# Altium schematic sheet mainSchema.SchDoc
size A4; SheetNumber: 1; SheetTotal: 9
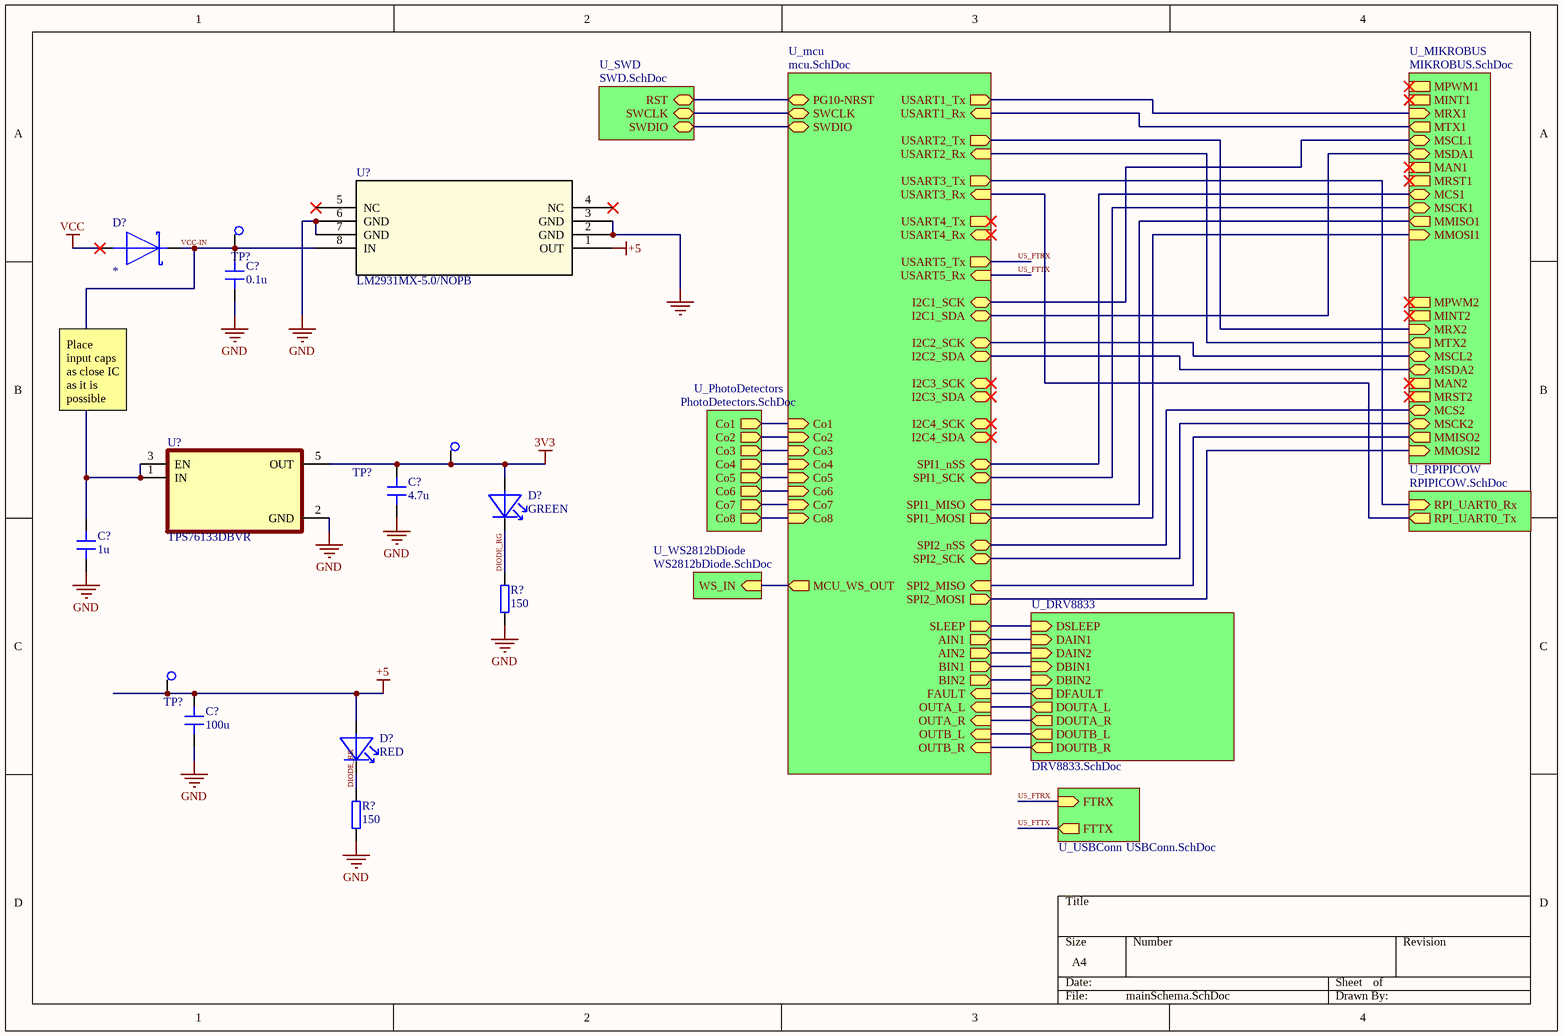
[diagram p0: mainSchema.SchDoc]

## Parts
(Parts that share a designator on the sheet are numbered #1, #2 ... from top to bottom, then left to right.)
C?#1  0.1u
C?#2  4.7u
C?#3  1u
C?#4  100u
D?#1  *
D?#2  GREEN
D?#3  RED
R?#1  150
R?#2  150
TP?#1  *  [TestPoint]  (value not drawn)
TP?#2  *  [TestPoint]  (value not drawn)
TP?#3  *  [TestPoint]  (value not drawn)
U?#1  LM2931MX-5.0/NOPB  [M08A_TEX]
U?#2  TPS76133DBVR  [SOT95P280X145-5N]

## Sub-sheets
U_DRV8833 = DRV8833.SchDoc: DOUTB_R (out), DOUTA_R (out), DOUTB_L (out), DOUTA_L (out), DAIN1 (in), DBIN1 (in), DAIN2 (in), DBIN2 (in), DSLEEP (in), DFAULT (out)
U_mcu = mcu.SchDoc: PG10-NRST (bidir), SWCLK (bidir), SWDIO (bidir), USART1_Tx (out), USART1_Rx (in), USART2_Tx (out), USART2_Rx (in), USART3_Tx (out), USART3_Rx (in), USART4_Tx (out), USART4_Rx (in), USART5_Tx (out), USART5_Rx (in), I2C1_SCK (bidir), I2C1_SDA (bidir), I2C2_SCK (bidir), I2C2_SDA (bidir), I2C3_SCK (bidir), I2C3_SDA (bidir), I2C4_SCK (bidir), I2C4_SDA (bidir), SPI1_nSS (bidir), SPI1_SCK (bidir), SPI1_MISO (in), SPI1_MOSI (out), SPI2_nSS (bidir), SPI2_SCK (bidir), SPI2_MISO (in), SPI2_MOSI (out), Co1 (in), Co2 (in), Co3 (in), Co4 (in), Co5 (in), Co6 (in), Co7 (in), Co8 (in), AIN1 (out), AIN2 (out), BIN1 (out), BIN2 (out), FAULT (in), OUTA_L (in), OUTA_R (in), OUTB_L (in), OUTB_R (in), SLEEP (out), MCU_WS_OUT (out)
U_MIKROBUS = MIKROBUS.SchDoc: MPWM1, MINT1, MRX1 (in), MTX1 (out), MSCL1 (bidir), MSDA1 (bidir), MAN1, MRST1, MCS1 (bidir), MSCK1 (bidir), MMISO1 (out), MMOSI1 (in), MPWM2, MINT2, MRX2 (in), MTX2 (out), MSCL2 (bidir), MSDA2 (bidir), MAN2, MRST2, MCS2 (bidir), MSCK2 (bidir), MMISO2 (out), MMOSI2 (in)
U_PhotoDetectors = PhotoDetectors.SchDoc: Co1 (out), Co2 (out), Co3 (out), Co4 (out), Co5 (out), Co6 (out), Co7 (out), Co8 (out)
U_RPIPICOW = RPIPICOW.SchDoc: RPI_UART0_Tx (out), RPI_UART0_Rx (in)
U_SWD = SWD.SchDoc: SWDIO (bidir), SWCLK (bidir), RST (bidir)
U_USBConn = USBConn.SchDoc: FTRX (in), FTTX (out)
U_WS2812bDiode = WS2812bDiode.SchDoc: WS_IN (in)

## Nets
3V3: C?#2.2 D?#2.1 TP?#2.1 U?#2.5(OUT)
+5: C?#4.2 D?#3.1 TP?#3.1 U?#1.1(OUT)
GND: C?#1.1 C?#2.1 C?#3.1 C?#4.1 R?#1.1 R?#2.1 U?#1.6(GND) U?#1.7(GND) U?#2.2(GND)
NetU?#1_2: U?#1.2(GND) U?#1.3(GND)
VCC: D?#1.1
DIODE_RG: D?#2.2 R?#1.2
DIODE_RR: D?#3.2 R?#2.2
U5_FTRX: sheet U_mcu/USART5_Tx, sheet U_USBConn/FTRX
U5_FTTX: sheet U_mcu/USART5_Rx, sheet U_USBConn/FTTX
VCC-IN: C?#1.2 C?#3.2 D?#1.2 TP?#1.1 U?#1.8(IN) U?#2.1(IN) U?#2.3(EN)
(unnamed): sheet U_mcu/PG10-NRST, sheet U_SWD/RST
(unnamed): sheet U_mcu/SWCLK, sheet U_SWD/SWCLK
(unnamed): sheet U_mcu/SWDIO, sheet U_SWD/SWDIO
(unnamed): sheet U_mcu/USART1_Tx, sheet U_MIKROBUS/MRX1
(unnamed): sheet U_mcu/USART1_Rx, sheet U_MIKROBUS/MTX1
(unnamed): sheet U_mcu/USART2_Tx, sheet U_MIKROBUS/MRX2
(unnamed): sheet U_mcu/USART2_Rx, sheet U_MIKROBUS/MTX2
(unnamed): sheet U_mcu/USART3_Tx, sheet U_RPIPICOW/RPI_UART0_Rx
(unnamed): sheet U_mcu/USART3_Rx, sheet U_RPIPICOW/RPI_UART0_Tx
(unnamed): sheet U_mcu/I2C1_SCK, sheet U_MIKROBUS/MSCL1
(unnamed): sheet U_mcu/I2C1_SDA, sheet U_MIKROBUS/MSDA1
(unnamed): sheet U_mcu/I2C2_SCK, sheet U_MIKROBUS/MSCL2
(unnamed): sheet U_mcu/I2C2_SDA, sheet U_MIKROBUS/MSDA2
(unnamed): sheet U_mcu/SPI1_nSS, sheet U_MIKROBUS/MCS1
(unnamed): sheet U_mcu/SPI1_SCK, sheet U_MIKROBUS/MSCK1
(unnamed): sheet U_mcu/SPI1_MISO, sheet U_MIKROBUS/MMISO1
(unnamed): sheet U_mcu/SPI1_MOSI, sheet U_MIKROBUS/MMOSI1
(unnamed): sheet U_mcu/SPI2_nSS, sheet U_MIKROBUS/MCS2
(unnamed): sheet U_mcu/SPI2_SCK, sheet U_MIKROBUS/MSCK2
(unnamed): sheet U_mcu/SPI2_MISO, sheet U_MIKROBUS/MMISO2
(unnamed): sheet U_mcu/SPI2_MOSI, sheet U_MIKROBUS/MMOSI2
(unnamed): sheet U_mcu/Co1, sheet U_PhotoDetectors/Co1
(unnamed): sheet U_mcu/Co2, sheet U_PhotoDetectors/Co2
(unnamed): sheet U_mcu/Co3, sheet U_PhotoDetectors/Co3
(unnamed): sheet U_mcu/Co4, sheet U_PhotoDetectors/Co4
(unnamed): sheet U_mcu/Co5, sheet U_PhotoDetectors/Co5
(unnamed): sheet U_mcu/Co6, sheet U_PhotoDetectors/Co6
(unnamed): sheet U_mcu/Co7, sheet U_PhotoDetectors/Co7
(unnamed): sheet U_mcu/Co8, sheet U_PhotoDetectors/Co8
(unnamed): sheet U_mcu/AIN1, sheet U_DRV8833/DAIN1
(unnamed): sheet U_mcu/AIN2, sheet U_DRV8833/DAIN2
(unnamed): sheet U_mcu/BIN1, sheet U_DRV8833/DBIN1
(unnamed): sheet U_mcu/BIN2, sheet U_DRV8833/DBIN2
(unnamed): sheet U_mcu/FAULT, sheet U_DRV8833/DFAULT
(unnamed): sheet U_mcu/OUTA_L, sheet U_DRV8833/DOUTA_L
(unnamed): sheet U_mcu/OUTA_R, sheet U_DRV8833/DOUTA_R
(unnamed): sheet U_mcu/OUTB_L, sheet U_DRV8833/DOUTB_L
(unnamed): sheet U_mcu/OUTB_R, sheet U_DRV8833/DOUTB_R
(unnamed): sheet U_mcu/SLEEP, sheet U_DRV8833/DSLEEP
(unnamed): sheet U_mcu/MCU_WS_OUT, sheet U_WS2812bDiode/WS_IN

Not connected (* = marked no-connect by the designer): U?#1 4(NC)* 5(NC)*

## Notes on the sheet
- Place input caps as close IC as it is possible

## Library data of the parts
C?#1-C?#4 = Capacitor: Value: *; HelpURL: *; MPN: *; Supplier: *; SupplierPartNumber: *
D?#1 = Schotky: Value: *; HelpURL: *; MPN: *; Supplier: *; SupplierPartNumber: *
D?#2 D?#3 = LED: Value: *; HelpURL: *; MPN: *; Supplier: *; SupplierPartNumber: *
R?#1 R?#2 = Resistor: Value: *; HelpURL: *; MPN: *; Supplier: *; SupplierPartNumber: *
TP?#1-TP?#3 = TP: Value: *; HelpURL: *; MPN: *; Supplier: *; SupplierPartNumber: *
U?#1 = LM2931MX-5.0NOPB: No Description Available; Mfr_Name: Texas Instruments; Copyright: Copyright (C) 2023 Ultra Librarian. All rights reserved.; Manufacturer_Part_Number: LM2931MX-5.0/NOPB; RefDes: RefDes; Type: DEV
U?#2 = TPS76133DBVR: 100-mA, 16-V, low-dropout voltage regulator with reverse current protection 5-SOT-23 -40 to 125; MF: Texas Instruments; Price: None; MP: TPS76133DBVR; Mouser-Purchase-URL: https://snapeda.com/shop?store=Mouser&id=582733; SnapEDA_Link: https://www.snapeda.com/parts/TPS76133DBVR/Texas%20Instruments/view-part/582733/?ref=snap; Package: SOT-23-5 Texas Instruments; DigiKey-Purchase-URL: https://snapeda.com/shop?store=DigiKey&id=582733; Availability: Good; Texas_Instruments-Purchase-URL: https://snapeda.com/shop?store=Texas+Instruments&id=582733; Value: *